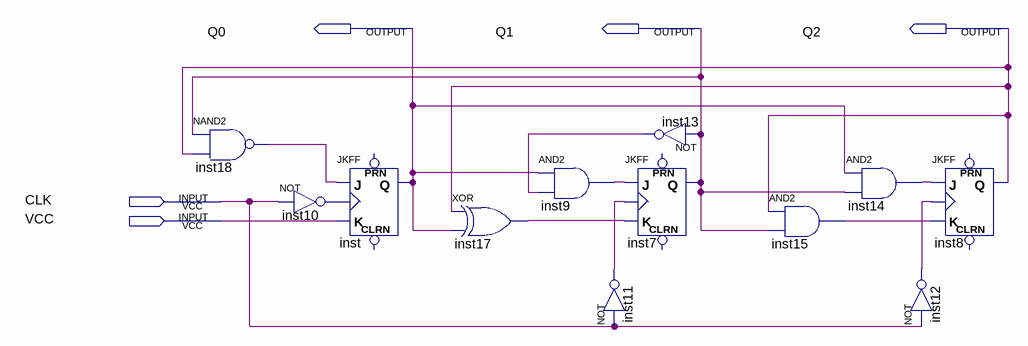
[diagram p0: schematic sheet]
// Quartus schematic 3counter.bdf as structural Verilog: 12 symbols, 5 pins
module \3counter  (
  input  CLK,
  input  VCC,
  output Q0,
  output Q1,
  output Q2
);

  wire inst9_out, inst10_out, inst11_out, inst12_out, inst13_out, inst14_out, inst15_out, inst17_out,
       inst18_out;

  nand inst18 (inst18_out, Q1, Q2);
  not inst10 (inst10_out, CLK);
  JKFF inst (.K(VCC), .J(inst18_out), .CLK(inst10_out), .Q(Q0));  // open: PRN, CLRN
  xor inst17 (inst17_out, Q2, Q0);
  and inst9 (inst9_out, Q0, inst13_out);
  JKFF inst7 (.K(inst17_out), .J(inst9_out), .CLK(inst11_out), .Q(Q1));  // open: PRN, CLRN
  not inst11 (inst11_out, CLK);
  not inst13 (inst13_out, Q1);
  and inst15 (inst15_out, Q2, Q1);
  and inst14 (inst14_out, Q0, Q1);
  JKFF inst8 (.K(inst15_out), .J(inst14_out), .CLK(inst12_out), .Q(Q2));  // open: PRN, CLRN
  not inst12 (inst12_out, CLK);
endmodule
